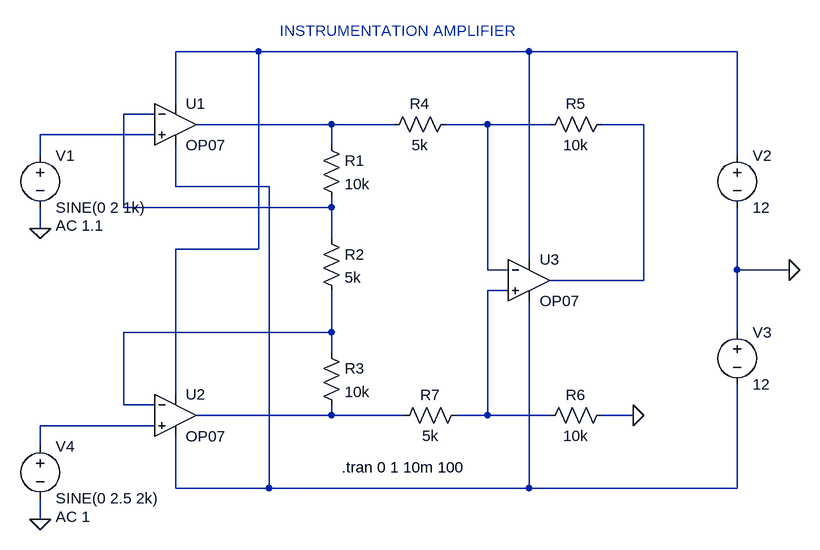
[diagram p0: schematic Instrumentation amplifier.asc]
Instrumentation amplifier.asc, the LTspice schematic file:
Version 4
SHEET 1 1108 680
WIRE 272 -176 144 -176
WIRE 688 -176 272 -176
WIRE 1008 -176 688 -176
WIRE 144 -96 144 -176
WIRE 112 -80 64 -80
WIRE 384 -64 176 -64
WIRE 480 -64 384 -64
WIRE 624 -64 560 -64
WIRE 720 -64 624 -64
WIRE 864 -64 800 -64
WIRE 112 -48 -64 -48
WIRE 384 -32 384 -64
WIRE -64 -16 -64 -48
WIRE 1008 -16 1008 -176
WIRE 144 32 144 -32
WIRE 288 32 144 32
WIRE 64 64 64 -80
WIRE 384 64 384 48
WIRE 384 64 64 64
WIRE -64 96 -64 64
WIRE 384 112 384 64
WIRE 272 128 272 -176
WIRE 272 128 144 128
WIRE 688 144 688 -176
WIRE 624 160 624 -64
WIRE 656 160 624 160
WIRE 1008 160 1008 64
WIRE 1088 160 1008 160
WIRE 864 176 864 -64
WIRE 864 176 720 176
WIRE 656 192 624 192
WIRE 384 256 384 192
WIRE 384 256 64 256
WIRE 1008 256 1008 160
WIRE 384 288 384 256
WIRE 144 352 144 128
WIRE 64 368 64 256
WIRE 112 368 64 368
WIRE 384 384 384 368
WIRE 384 384 176 384
WIRE 496 384 384 384
WIRE 624 384 624 192
WIRE 624 384 576 384
WIRE 720 384 624 384
WIRE 848 384 800 384
WIRE 112 400 -64 400
WIRE -64 432 -64 400
WIRE 144 496 144 416
WIRE 288 496 288 32
WIRE 288 496 144 496
WIRE 688 496 688 208
WIRE 688 496 288 496
WIRE 1008 496 1008 336
WIRE 1008 496 688 496
WIRE -64 544 -64 512
FLAG 848 384 0
FLAG 1088 160 0
FLAG -64 96 0
FLAG -64 544 0
SYMBOL OpAmps\\OP07 144 -128 R0
SYMATTR InstName U1
SYMBOL OpAmps\\OP07 144 320 R0
SYMATTR InstName U2
SYMBOL OpAmps\\OP07 688 112 R0
SYMATTR InstName U3
SYMBOL res 368 -48 R0
SYMATTR InstName R1
SYMATTR Value 10k
SYMBOL res 368 96 R0
SYMATTR InstName R2
SYMATTR Value 5k
SYMBOL res 368 272 R0
SYMATTR InstName R3
SYMATTR Value 10k
SYMBOL res 576 -80 R90
WINDOW 0 0 56 VBottom 2
WINDOW 3 32 56 VTop 2
SYMATTR InstName R4
SYMATTR Value 5k
SYMBOL res 592 368 R90
WINDOW 0 0 56 VBottom 2
WINDOW 3 32 56 VTop 2
SYMATTR InstName R7
SYMATTR Value 5k
SYMBOL res 816 -80 R90
WINDOW 0 0 56 VBottom 2
WINDOW 3 32 56 VTop 2
SYMATTR InstName R5
SYMATTR Value 10k
SYMBOL res 816 368 R90
WINDOW 0 0 56 VBottom 2
WINDOW 3 32 56 VTop 2
SYMATTR InstName R6
SYMATTR Value 10k
SYMBOL voltage -64 -32 R0
WINDOW 123 24 124 Left 2
WINDOW 39 0 0 Left 0
SYMATTR Value2 AC 1.1
SYMATTR InstName V1
SYMATTR Value SINE(0 2 1k)
SYMBOL voltage -64 416 R0
WINDOW 123 24 124 Left 2
WINDOW 39 0 0 Left 0
SYMATTR Value2 AC 1
SYMATTR InstName V4
SYMATTR Value SINE(0 2.5 2k)
SYMBOL voltage 1008 -32 R0
SYMATTR InstName V2
SYMATTR Value 12
SYMBOL voltage 1008 240 R0
SYMATTR InstName V3
SYMATTR Value 12
TEXT 400 464 Left 2 !.tran 0 1 10m 100
TEXT 304 -208 Left 2 ;INSTRUMENTATION AMPLIFIER

The netlist it stands for:
* Instrumentation amplifier.asc
XU1 N006 N002 N001 N007 N003 LT1001  ; OP07, pins In+ In- V+ V- OUT
XU2 N011 N009 N001 N007 N010 LT1001  ; OP07, pins In+ In- V+ V- OUT
XU3 N008 N004 N001 N007 N005 LT1001  ; OP07, pins In+ In- V+ V- OUT
R1 N003 N002 10k
R2 N002 N009 5k
R3 N009 N010 10k
R4 N004 N003 5k
R7 N008 N010 5k
R5 N005 N004 10k
R6 0 N008 10k
V1 N006 0 SINE(0 2 1k) AC 1.1
V4 N011 0 SINE(0 2.5 2k) AC 1
V2 N001 0 12
V3 0 N007 12
.tran 0 1 10m 100
* INSTRUMENTATION AMPLIFIER
.lib LTC.lib
.backanno
.end